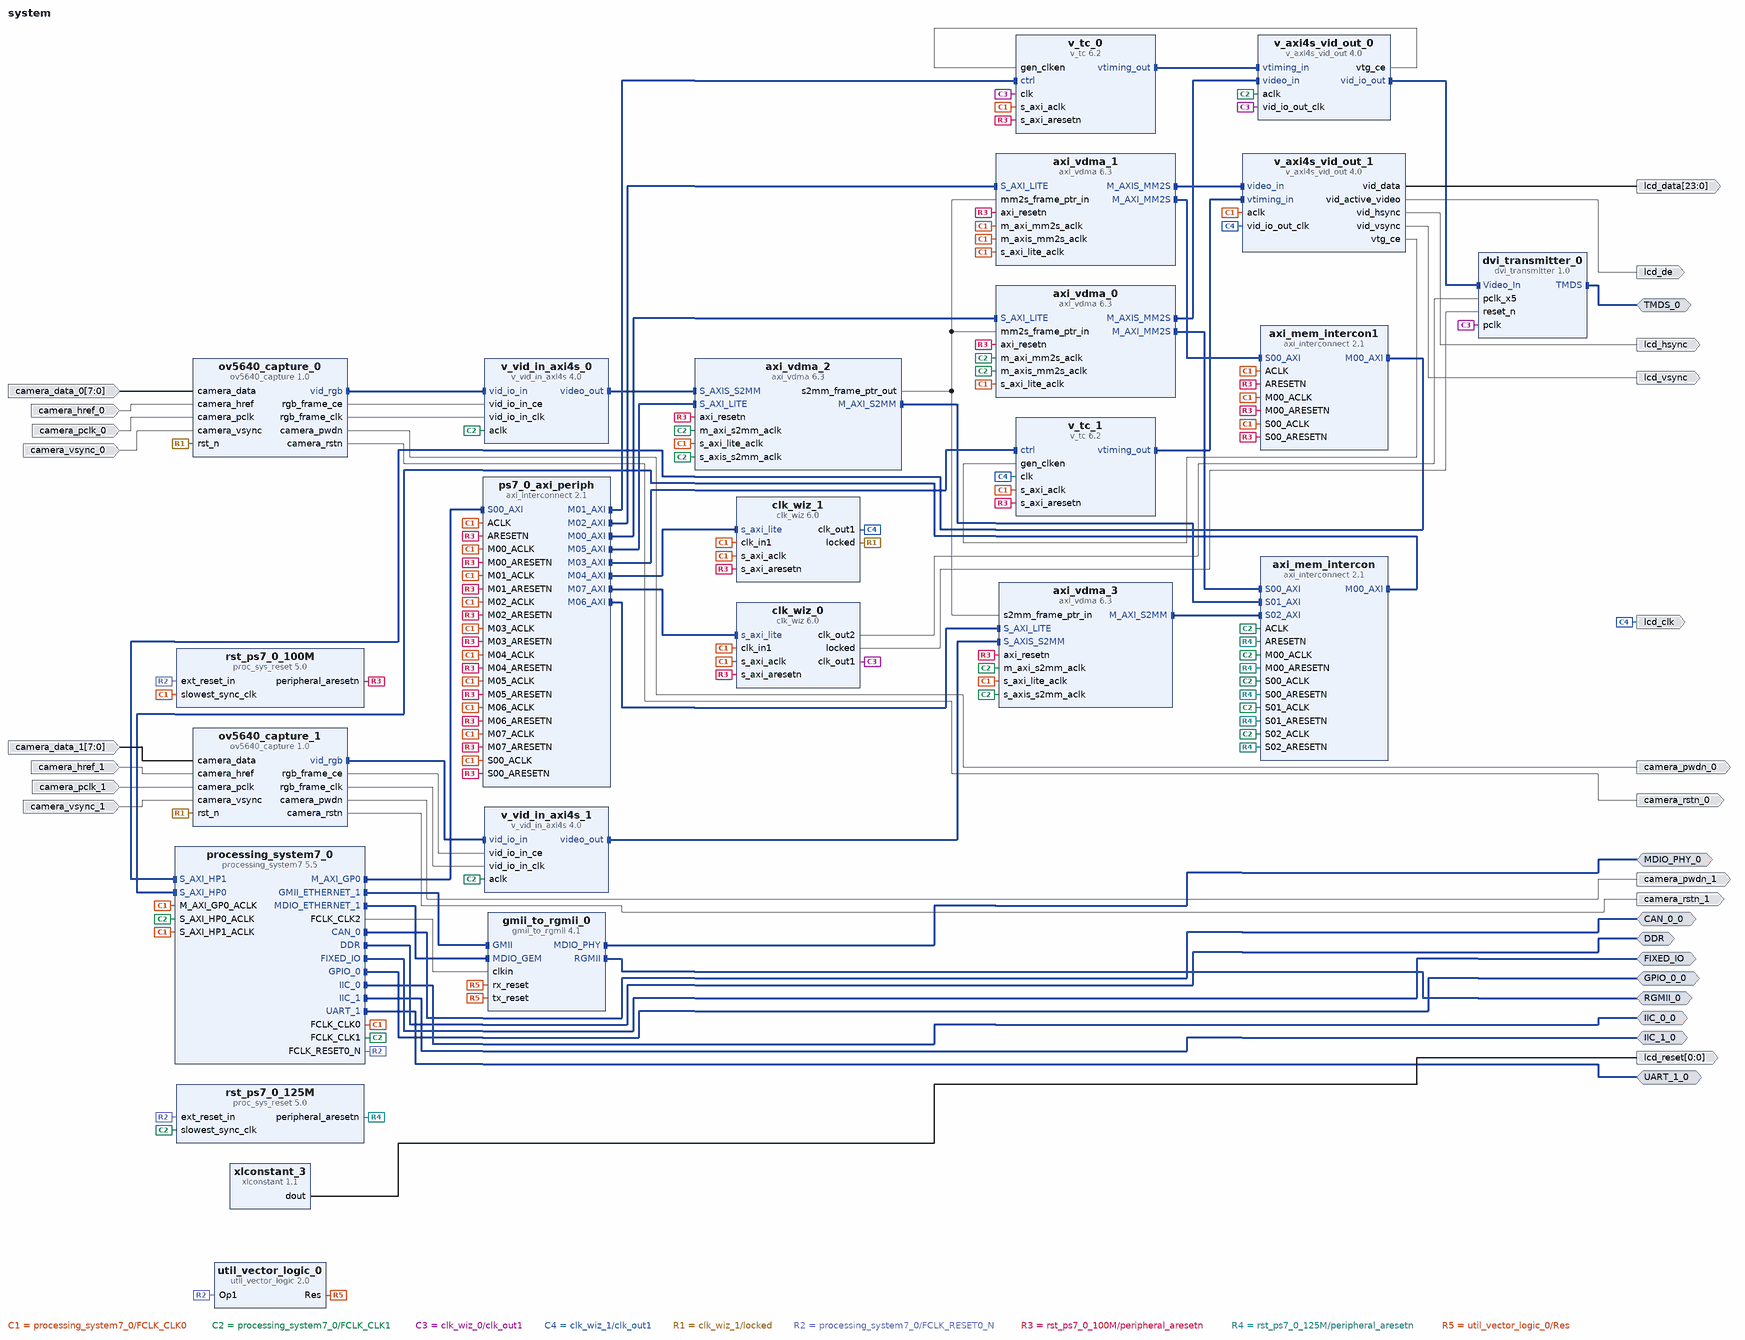
[diagram p0: block diagram of the top level]
# Vivado block design system, xc7z020clg400-2, Vivado 2021.1
create_bd_design system

create_bd_intf_port -mode Master -vlnv xilinx.com:interface:ddrx_rtl:1.0 DDR
create_bd_intf_port -mode Master -vlnv xilinx.com:display_processing_system7:fixedio_rtl:1.0 FIXED_IO
create_bd_intf_port -mode Master -vlnv xilinx.com:interface:iic_rtl:1.0 IIC_0_0
create_bd_intf_port -mode Master -vlnv xilinx.com:interface:gpio_rtl:1.0 GPIO_0_0
create_bd_intf_port -mode Master -vlnv xilinx.com:interface:can_rtl:1.0 CAN_0_0
create_bd_intf_port -mode Master -vlnv xilinx.com:interface:uart_rtl:1.0 UART_1_0
create_bd_intf_port -mode Master -vlnv xilinx.com:interface:mdio_rtl:1.0 MDIO_PHY_0
create_bd_intf_port -mode Master -vlnv xilinx.com:interface:rgmii_rtl:1.0 RGMII_0
create_bd_intf_port -mode Master -vlnv xilinx.com:interface:iic_rtl:1.0 IIC_1_0
create_bd_intf_port -mode Master -vlnv minstru.com:user:TMDS_rtl:1.0 TMDS_0
create_bd_port -dir O lcd_de
create_bd_port -dir O lcd_hsync
create_bd_port -dir O lcd_vsync
create_bd_port -dir O lcd_clk
create_bd_port -dir O -from 0 -to 0 lcd_reset
create_bd_port -dir O -from 23 -to 0 lcd_data
create_bd_port -dir O -type rst camera_rstn_0
create_bd_port -dir O camera_pwdn_0
create_bd_port -dir I camera_pclk_0
create_bd_port -dir I camera_vsync_0
create_bd_port -dir I camera_href_0
create_bd_port -dir I -from 7 -to 0 camera_data_0
create_bd_port -dir I camera_pclk_1
create_bd_port -dir I camera_vsync_1
create_bd_port -dir I camera_href_1
create_bd_port -dir I -from 7 -to 0 camera_data_1
create_bd_port -dir O -type rst camera_rstn_1
create_bd_port -dir O camera_pwdn_1

create_bd_cell -type ip -vlnv xilinx.com:ip:processing_system7:5.5 processing_system7_0
set_property -dict [list \
  CONFIG.PCW_APU_PERIPHERAL_FREQMHZ 666.666666 \
  CONFIG.PCW_CAN0_CAN0_IO EMIO \
  CONFIG.PCW_CAN0_PERIPHERAL_ENABLE 1 \
  CONFIG.PCW_CPU_CPU_6X4X_MAX_RANGE 767 \
  CONFIG.PCW_ENET0_ENET0_IO {MIO 16 .. 27} \
  CONFIG.PCW_ENET0_GRP_MDIO_ENABLE 1 \
  CONFIG.PCW_ENET0_GRP_MDIO_IO {MIO 52 .. 53} \
  CONFIG.PCW_ENET0_PERIPHERAL_ENABLE 1 \
  CONFIG.PCW_ENET0_RESET_ENABLE 0 \
  CONFIG.PCW_ENET1_ENET1_IO EMIO \
  CONFIG.PCW_ENET1_GRP_MDIO_ENABLE 1 \
  CONFIG.PCW_ENET1_GRP_MDIO_IO EMIO \
  CONFIG.PCW_ENET1_PERIPHERAL_ENABLE 1 \
  CONFIG.PCW_ENET_RESET_ENABLE 1 \
  CONFIG.PCW_ENET_RESET_SELECT {Share reset pin} \
  CONFIG.PCW_EN_CLK1_PORT 1 \
  CONFIG.PCW_EN_CLK2_PORT 1 \
  CONFIG.PCW_FCLK_CLK0_BUF FALSE \
  CONFIG.PCW_FCLK_CLK1_BUF TRUE \
  CONFIG.PCW_FPGA0_PERIPHERAL_FREQMHZ 100 \
  CONFIG.PCW_FPGA1_PERIPHERAL_FREQMHZ 125 \
  CONFIG.PCW_FPGA2_PERIPHERAL_FREQMHZ 200 \
  CONFIG.PCW_FPGA_FCLK1_ENABLE 1 \
  CONFIG.PCW_FPGA_FCLK2_ENABLE 1 \
  CONFIG.PCW_GPIO_EMIO_GPIO_ENABLE 1 \
  CONFIG.PCW_GPIO_EMIO_GPIO_IO 12 \
  CONFIG.PCW_GPIO_EMIO_GPIO_WIDTH 12 \
  CONFIG.PCW_GPIO_MIO_GPIO_ENABLE 1 \
  CONFIG.PCW_GPIO_MIO_GPIO_IO MIO \
  CONFIG.PCW_I2C0_I2C0_IO EMIO \
  CONFIG.PCW_I2C0_PERIPHERAL_ENABLE 1 \
  CONFIG.PCW_I2C1_I2C1_IO EMIO \
  CONFIG.PCW_I2C1_PERIPHERAL_ENABLE 1 \
  CONFIG.PCW_I2C_PERIPHERAL_FREQMHZ 111.111115 \
  CONFIG.PCW_I2C_RESET_ENABLE 0 \
  CONFIG.PCW_PERIPHERAL_BOARD_PRESET None \
  CONFIG.PCW_PRESET_BANK1_VOLTAGE {LVCMOS 1.8V} \
  CONFIG.PCW_QSPI_GRP_SINGLE_SS_ENABLE 1 \
  CONFIG.PCW_QSPI_GRP_SINGLE_SS_IO {MIO 1 .. 6} \
  CONFIG.PCW_QSPI_PERIPHERAL_ENABLE 1 \
  CONFIG.PCW_QSPI_QSPI_IO {MIO 1 .. 6} \
  CONFIG.PCW_SD0_GRP_CD_ENABLE 1 \
  CONFIG.PCW_SD0_GRP_CD_IO {MIO 9} \
  CONFIG.PCW_SD0_GRP_WP_ENABLE 0 \
  CONFIG.PCW_SD0_PERIPHERAL_ENABLE 1 \
  CONFIG.PCW_SD0_SD0_IO {MIO 40 .. 45} \
  CONFIG.PCW_SD1_PERIPHERAL_ENABLE 1 \
  CONFIG.PCW_SD1_SD1_IO {MIO 46 .. 51} \
  CONFIG.PCW_SDIO_PERIPHERAL_FREQMHZ 100 \
  CONFIG.PCW_SINGLE_QSPI_DATA_MODE x4 \
  CONFIG.PCW_UART0_PERIPHERAL_ENABLE 1 \
  CONFIG.PCW_UART0_UART0_IO {MIO 14 .. 15} \
  CONFIG.PCW_UART1_PERIPHERAL_ENABLE 1 \
  CONFIG.PCW_UART1_UART1_IO EMIO \
  CONFIG.PCW_UART_PERIPHERAL_FREQMHZ 100 \
  CONFIG.PCW_UIPARAM_DDR_FREQ_MHZ 533.333333 \
  CONFIG.PCW_UIPARAM_DDR_MEMORY_TYPE {DDR 3 (Low Voltage)} \
  CONFIG.PCW_UIPARAM_DDR_PARTNO {MT41K256M16 RE-125} \
  CONFIG.PCW_USB0_PERIPHERAL_ENABLE 1 \
  CONFIG.PCW_USB0_RESET_ENABLE 1 \
  CONFIG.PCW_USB0_RESET_IO {MIO 10} \
  CONFIG.PCW_USB0_USB0_IO {MIO 28 .. 39} \
  CONFIG.PCW_USB_RESET_ENABLE 1 \
  CONFIG.PCW_USB_RESET_SELECT {Share reset pin} \
  CONFIG.PCW_USE_S_AXI_HP0 1 \
  CONFIG.PCW_USE_S_AXI_HP1 1 \
  CONFIG.preset None \
] [get_bd_cells processing_system7_0]
# 513 more settings of processing_system7_0 are not shown: defaults, MIO pin electricals, DDR timing, and values the tool derives
create_bd_cell -type ip -vlnv xilinx.com:ip:axi_vdma:6.3 axi_vdma_0
set_property -dict [list \
  CONFIG.c_include_s2mm 0 \
  CONFIG.c_m_axis_mm2s_tdata_width 24 \
  CONFIG.c_mm2s_genlock_mode 1 \
  CONFIG.c_mm2s_linebuffer_depth 2048 \
  CONFIG.c_mm2s_max_burst_length 64 \
  CONFIG.c_num_fstores 1 \
] [get_bd_cells axi_vdma_0]
create_bd_cell -type ip -vlnv xilinx.com:ip:v_tc:6.2 v_tc_0
set_property -dict {CONFIG.enable_detection false} [get_bd_cells v_tc_0]
create_bd_cell -type ip -vlnv xilinx.com:ip:v_axi4s_vid_out:4.0 v_axi4s_vid_out_0
set_property -dict {CONFIG.C_HAS_ASYNC_CLK 1} [get_bd_cells v_axi4s_vid_out_0]
create_bd_cell -type ip -vlnv xilinx.com:ip:clk_wiz:6.0 clk_wiz_0
set_property -dict [list \
  CONFIG.CLKOUT1_DRIVES BUFG \
  CONFIG.CLKOUT1_JITTER 151.636 \
  CONFIG.CLKOUT1_PHASE_ERROR 98.575 \
  CONFIG.CLKOUT1_REQUESTED_OUT_FREQ 50 \
  CONFIG.CLKOUT2_DRIVES No_buffer \
  CONFIG.CLKOUT2_JITTER 110.209 \
  CONFIG.CLKOUT2_PHASE_ERROR 98.575 \
  CONFIG.CLKOUT2_REQUESTED_OUT_FREQ 250 \
  CONFIG.CLKOUT2_USED true \
  CONFIG.CLKOUT3_DRIVES BUFG \
  CONFIG.CLKOUT4_DRIVES BUFG \
  CONFIG.CLKOUT5_DRIVES BUFG \
  CONFIG.CLKOUT6_DRIVES BUFG \
  CONFIG.CLKOUT7_DRIVES BUFG \
  CONFIG.MMCM_CLKFBOUT_MULT_F 10.000 \
  CONFIG.MMCM_CLKOUT0_DIVIDE_F 20.000 \
  CONFIG.MMCM_CLKOUT1_DIVIDE 4 \
  CONFIG.MMCM_DIVCLK_DIVIDE 1 \
  CONFIG.NUM_OUT_CLKS 2 \
  CONFIG.SECONDARY_SOURCE Single_ended_clock_capable_pin \
  CONFIG.USE_DYN_RECONFIG true \
  CONFIG.USE_PHASE_ALIGNMENT true \
] [get_bd_cells clk_wiz_0]
create_bd_cell -type ip -vlnv xilinx.com:ip:axi_interconnect:2.1 ps7_0_axi_periph
set_property -dict {CONFIG.NUM_MI 8} [get_bd_cells ps7_0_axi_periph]
create_bd_cell -type ip -vlnv xilinx.com:ip:proc_sys_reset:5.0 rst_ps7_0_100M
create_bd_cell -type ip -vlnv xilinx.com:ip:axi_interconnect:2.1 axi_mem_intercon
set_property -dict {CONFIG.NUM_MI 1 CONFIG.NUM_SI 3} [get_bd_cells axi_mem_intercon]
create_bd_cell -type ip -vlnv xilinx.com:ip:proc_sys_reset:5.0 rst_ps7_0_125M
create_bd_cell -type ip -vlnv xilinx.com:ip:util_vector_logic:2.0 util_vector_logic_0
set_property -dict {CONFIG.C_OPERATION not CONFIG.C_SIZE 1} [get_bd_cells util_vector_logic_0]
create_bd_cell -type ip -vlnv xilinx.com:ip:v_axi4s_vid_out:4.0 v_axi4s_vid_out_1
set_property -dict {CONFIG.C_HAS_ASYNC_CLK 1 CONFIG.C_NATIVE_COMPONENT_WIDTH 8} [get_bd_cells v_axi4s_vid_out_1]
create_bd_cell -type ip -vlnv xilinx.com:ip:v_tc:6.2 v_tc_1
set_property -dict [list \
  CONFIG.GEN_F0_VBLANK_HEND 1024 \
  CONFIG.GEN_F0_VBLANK_HSTART 1024 \
  CONFIG.GEN_F0_VFRAME_SIZE 635 \
  CONFIG.GEN_F0_VSYNC_HEND 1024 \
  CONFIG.GEN_F0_VSYNC_HSTART 1024 \
  CONFIG.GEN_F0_VSYNC_VEND 615 \
  CONFIG.GEN_F0_VSYNC_VSTART 612 \
  CONFIG.GEN_HACTIVE_SIZE 1024 \
  CONFIG.GEN_HFRAME_SIZE 1344 \
  CONFIG.GEN_HSYNC_END 1204 \
  CONFIG.GEN_HSYNC_START 1184 \
  CONFIG.GEN_VACTIVE_SIZE 600 \
  CONFIG.VIDEO_MODE Custom \
  CONFIG.enable_detection false \
] [get_bd_cells v_tc_1]
create_bd_cell -type ip -vlnv xilinx.com:ip:clk_wiz:6.0 clk_wiz_1
set_property -dict [list \
  CONFIG.CLKOUT1_JITTER 165.726 \
  CONFIG.CLKOUT1_PHASE_ERROR 98.575 \
  CONFIG.CLKOUT1_REQUESTED_OUT_FREQ 33.33333 \
  CONFIG.MMCM_CLKFBOUT_MULT_F 10.000 \
  CONFIG.MMCM_CLKOUT0_DIVIDE_F 30.000 \
  CONFIG.MMCM_DIVCLK_DIVIDE 1 \
  CONFIG.USE_DYN_RECONFIG true \
] [get_bd_cells clk_wiz_1]
create_bd_cell -type ip -vlnv xilinx.com:ip:axi_vdma:6.3 axi_vdma_1
set_property -dict [list \
  CONFIG.c_include_s2mm 0 \
  CONFIG.c_m_axis_mm2s_tdata_width 24 \
  CONFIG.c_mm2s_genlock_mode 1 \
  CONFIG.c_mm2s_linebuffer_depth 2048 \
  CONFIG.c_mm2s_max_burst_length 64 \
  CONFIG.c_num_fstores 3 \
] [get_bd_cells axi_vdma_1]
create_bd_cell -type ip -vlnv xilinx.com:ip:xlconstant:1.1 xlconstant_3
create_bd_cell -type ip -vlnv xilinx.com:ip:axi_interconnect:2.1 axi_mem_intercon1
set_property -dict {CONFIG.NUM_MI 1 CONFIG.NUM_SI 1} [get_bd_cells axi_mem_intercon1]
create_bd_cell -type ip -vlnv xilinx.com:ip:gmii_to_rgmii:4.1 gmii_to_rgmii_0
set_property -dict {CONFIG.SupportLevel Include_Shared_Logic_in_Core} [get_bd_cells gmii_to_rgmii_0]
create_bd_cell -type ip -vlnv xilinx.com:ip:v_vid_in_axi4s:4.0 v_vid_in_axi4s_0
set_property -dict {CONFIG.C_HAS_ASYNC_CLK 1} [get_bd_cells v_vid_in_axi4s_0]
create_bd_cell -type ip -vlnv xilinx.com:ip:v_vid_in_axi4s:4.0 v_vid_in_axi4s_1
set_property -dict {CONFIG.C_HAS_ASYNC_CLK 1} [get_bd_cells v_vid_in_axi4s_1]
create_bd_cell -type ip -vlnv xilinx.com:ip:axi_vdma:6.3 axi_vdma_2
set_property -dict [list \
  CONFIG.c_include_mm2s 0 \
  CONFIG.c_include_s2mm 1 \
  CONFIG.c_mm2s_genlock_mode 0 \
  CONFIG.c_num_fstores 3 \
  CONFIG.c_s2mm_genlock_mode 0 \
  CONFIG.c_s2mm_linebuffer_depth 2048 \
  CONFIG.c_s2mm_max_burst_length 64 \
] [get_bd_cells axi_vdma_2]
create_bd_cell -type ip -vlnv xilinx.com:ip:axi_vdma:6.3 axi_vdma_3
set_property -dict [list \
  CONFIG.c_include_mm2s 0 \
  CONFIG.c_include_s2mm 1 \
  CONFIG.c_m_axis_mm2s_tdata_width 32 \
  CONFIG.c_mm2s_genlock_mode 0 \
  CONFIG.c_num_fstores 3 \
  CONFIG.c_s2mm_genlock_mode 1 \
  CONFIG.c_s2mm_linebuffer_depth 2048 \
  CONFIG.c_s2mm_max_burst_length 64 \
] [get_bd_cells axi_vdma_3]
create_bd_cell -type ip -vlnv minstru.com:user:ov5640_capture:1.0 ov5640_capture_0
create_bd_cell -type ip -vlnv minstru.com:user:ov5640_capture:1.0 ov5640_capture_1
create_bd_cell -type ip -vlnv minstru.com:user:dvi_transmitter:1.0 dvi_transmitter_0

# ---- connections ----

connect_bd_intf_net [get_bd_intf_pins axi_mem_intercon1/M00_AXI] [get_bd_intf_pins processing_system7_0/S_AXI_HP1]
connect_bd_intf_net [get_bd_intf_pins axi_mem_intercon/M00_AXI] [get_bd_intf_pins processing_system7_0/S_AXI_HP0]
connect_bd_intf_net [get_bd_intf_pins axi_vdma_0/M_AXIS_MM2S] [get_bd_intf_pins v_axi4s_vid_out_0/video_in]
connect_bd_intf_net [get_bd_intf_pins axi_vdma_0/M_AXI_MM2S] [get_bd_intf_pins axi_mem_intercon/S00_AXI]
connect_bd_intf_net [get_bd_intf_pins axi_vdma_1/M_AXIS_MM2S] [get_bd_intf_pins v_axi4s_vid_out_1/video_in]
connect_bd_intf_net [get_bd_intf_pins axi_vdma_1/M_AXI_MM2S] [get_bd_intf_pins axi_mem_intercon1/S00_AXI]
connect_bd_intf_net [get_bd_intf_pins axi_vdma_2/M_AXI_S2MM] [get_bd_intf_pins axi_mem_intercon/S01_AXI]
connect_bd_intf_net [get_bd_intf_pins axi_vdma_3/M_AXI_S2MM] [get_bd_intf_pins axi_mem_intercon/S02_AXI]
connect_bd_intf_net [get_bd_intf_ports TMDS_0] [get_bd_intf_pins dvi_transmitter_0/TMDS]
connect_bd_intf_net [get_bd_intf_ports MDIO_PHY_0] [get_bd_intf_pins gmii_to_rgmii_0/MDIO_PHY]
connect_bd_intf_net [get_bd_intf_ports RGMII_0] [get_bd_intf_pins gmii_to_rgmii_0/RGMII]
connect_bd_intf_net [get_bd_intf_pins ov5640_capture_0/vid_rgb] [get_bd_intf_pins v_vid_in_axi4s_0/vid_io_in]
connect_bd_intf_net [get_bd_intf_pins ov5640_capture_1/vid_rgb] [get_bd_intf_pins v_vid_in_axi4s_1/vid_io_in]
connect_bd_intf_net [get_bd_intf_ports CAN_0_0] [get_bd_intf_pins processing_system7_0/CAN_0]
connect_bd_intf_net [get_bd_intf_ports DDR] [get_bd_intf_pins processing_system7_0/DDR]
connect_bd_intf_net [get_bd_intf_ports FIXED_IO] [get_bd_intf_pins processing_system7_0/FIXED_IO]
connect_bd_intf_net [get_bd_intf_pins processing_system7_0/GMII_ETHERNET_1] [get_bd_intf_pins gmii_to_rgmii_0/GMII]
connect_bd_intf_net [get_bd_intf_ports GPIO_0_0] [get_bd_intf_pins processing_system7_0/GPIO_0]
connect_bd_intf_net [get_bd_intf_ports IIC_0_0] [get_bd_intf_pins processing_system7_0/IIC_0]
connect_bd_intf_net [get_bd_intf_ports IIC_1_0] [get_bd_intf_pins processing_system7_0/IIC_1]
connect_bd_intf_net [get_bd_intf_pins processing_system7_0/MDIO_ETHERNET_1] [get_bd_intf_pins gmii_to_rgmii_0/MDIO_GEM]
connect_bd_intf_net [get_bd_intf_pins processing_system7_0/M_AXI_GP0] [get_bd_intf_pins ps7_0_axi_periph/S00_AXI]
connect_bd_intf_net [get_bd_intf_ports UART_1_0] [get_bd_intf_pins processing_system7_0/UART_1]
connect_bd_intf_net [get_bd_intf_pins ps7_0_axi_periph/M00_AXI] [get_bd_intf_pins axi_vdma_0/S_AXI_LITE]
connect_bd_intf_net [get_bd_intf_pins ps7_0_axi_periph/M01_AXI] [get_bd_intf_pins v_tc_0/ctrl]
connect_bd_intf_net [get_bd_intf_pins axi_vdma_1/S_AXI_LITE] [get_bd_intf_pins ps7_0_axi_periph/M02_AXI]
connect_bd_intf_net [get_bd_intf_pins ps7_0_axi_periph/M03_AXI] [get_bd_intf_pins v_tc_1/ctrl]
connect_bd_intf_net [get_bd_intf_pins ps7_0_axi_periph/M04_AXI] [get_bd_intf_pins clk_wiz_1/s_axi_lite]
connect_bd_intf_net [get_bd_intf_pins ps7_0_axi_periph/M05_AXI] [get_bd_intf_pins axi_vdma_2/S_AXI_LITE]
connect_bd_intf_net [get_bd_intf_pins ps7_0_axi_periph/M06_AXI] [get_bd_intf_pins axi_vdma_3/S_AXI_LITE]
connect_bd_intf_net [get_bd_intf_pins ps7_0_axi_periph/M07_AXI] [get_bd_intf_pins clk_wiz_0/s_axi_lite]
connect_bd_intf_net [get_bd_intf_pins v_axi4s_vid_out_0/vid_io_out] [get_bd_intf_pins dvi_transmitter_0/Video_In]
connect_bd_intf_net [get_bd_intf_pins v_tc_0/vtiming_out] [get_bd_intf_pins v_axi4s_vid_out_0/vtiming_in]
connect_bd_intf_net [get_bd_intf_pins v_tc_1/vtiming_out] [get_bd_intf_pins v_axi4s_vid_out_1/vtiming_in]
connect_bd_intf_net [get_bd_intf_pins v_vid_in_axi4s_0/video_out] [get_bd_intf_pins axi_vdma_2/S_AXIS_S2MM]
connect_bd_intf_net [get_bd_intf_pins v_vid_in_axi4s_1/video_out] [get_bd_intf_pins axi_vdma_3/S_AXIS_S2MM]
connect_bd_net [get_bd_pins processing_system7_0/FCLK_CLK0] \
  [get_bd_pins axi_vdma_0/s_axi_lite_aclk] [get_bd_pins v_tc_0/s_axi_aclk] [get_bd_pins clk_wiz_0/clk_in1] \
  [get_bd_pins processing_system7_0/M_AXI_GP0_ACLK] [get_bd_pins ps7_0_axi_periph/ACLK] \
  [get_bd_pins ps7_0_axi_periph/S00_ACLK] [get_bd_pins rst_ps7_0_100M/slowest_sync_clk] \
  [get_bd_pins ps7_0_axi_periph/M00_ACLK] [get_bd_pins ps7_0_axi_periph/M01_ACLK] [get_bd_pins clk_wiz_1/clk_in1] \
  [get_bd_pins v_axi4s_vid_out_1/aclk] [get_bd_pins ps7_0_axi_periph/M02_ACLK] [get_bd_pins v_tc_1/s_axi_aclk] \
  [get_bd_pins ps7_0_axi_periph/M03_ACLK] [get_bd_pins clk_wiz_1/s_axi_aclk] [get_bd_pins ps7_0_axi_periph/M04_ACLK] \
  [get_bd_pins processing_system7_0/S_AXI_HP1_ACLK] [get_bd_pins axi_vdma_1/s_axi_lite_aclk] \
  [get_bd_pins axi_vdma_1/m_axis_mm2s_aclk] [get_bd_pins axi_vdma_1/m_axi_mm2s_aclk] [get_bd_pins axi_mem_intercon1/M00_ACLK] \
  [get_bd_pins axi_mem_intercon1/S00_ACLK] [get_bd_pins axi_mem_intercon1/ACLK] [get_bd_pins axi_vdma_2/s_axi_lite_aclk] \
  [get_bd_pins axi_vdma_3/s_axi_lite_aclk] [get_bd_pins ps7_0_axi_periph/M05_ACLK] [get_bd_pins ps7_0_axi_periph/M06_ACLK] \
  [get_bd_pins ps7_0_axi_periph/M07_ACLK] [get_bd_pins clk_wiz_0/s_axi_aclk]
connect_bd_net [get_bd_pins processing_system7_0/FCLK_CLK1] \
  [get_bd_pins axi_vdma_0/m_axi_mm2s_aclk] [get_bd_pins v_axi4s_vid_out_0/aclk] [get_bd_pins axi_vdma_0/m_axis_mm2s_aclk] \
  [get_bd_pins processing_system7_0/S_AXI_HP0_ACLK] [get_bd_pins axi_mem_intercon/ACLK] \
  [get_bd_pins axi_mem_intercon/S00_ACLK] [get_bd_pins rst_ps7_0_125M/slowest_sync_clk] \
  [get_bd_pins axi_mem_intercon/M00_ACLK] [get_bd_pins axi_mem_intercon/S01_ACLK] [get_bd_pins axi_mem_intercon/S02_ACLK] \
  [get_bd_pins v_vid_in_axi4s_1/aclk] [get_bd_pins v_vid_in_axi4s_0/aclk] [get_bd_pins axi_vdma_3/s_axis_s2mm_aclk] \
  [get_bd_pins axi_vdma_3/m_axi_s2mm_aclk] [get_bd_pins axi_vdma_2/s_axis_s2mm_aclk] [get_bd_pins axi_vdma_2/m_axi_s2mm_aclk]
connect_bd_net [get_bd_pins axi_vdma_2/s2mm_frame_ptr_out] \
  [get_bd_pins axi_vdma_3/s2mm_frame_ptr_in] [get_bd_pins axi_vdma_0/mm2s_frame_ptr_in] \
  [get_bd_pins axi_vdma_1/mm2s_frame_ptr_in]
connect_bd_net -net camera_data_0_1 [get_bd_ports camera_data_0] [get_bd_pins ov5640_capture_0/camera_data]
connect_bd_net -net camera_data_1_1 [get_bd_ports camera_data_1] [get_bd_pins ov5640_capture_1/camera_data]
connect_bd_net -net camera_href_0_1 [get_bd_ports camera_href_0] [get_bd_pins ov5640_capture_0/camera_href]
connect_bd_net -net camera_href_1_1 [get_bd_ports camera_href_1] [get_bd_pins ov5640_capture_1/camera_href]
connect_bd_net -net camera_pclk_0_1 [get_bd_ports camera_pclk_0] [get_bd_pins ov5640_capture_0/camera_pclk]
connect_bd_net -net camera_pclk_1_1 [get_bd_ports camera_pclk_1] [get_bd_pins ov5640_capture_1/camera_pclk]
connect_bd_net -net camera_vsync_0_1 [get_bd_ports camera_vsync_0] [get_bd_pins ov5640_capture_0/camera_vsync]
connect_bd_net -net camera_vsync_1_1 [get_bd_ports camera_vsync_1] [get_bd_pins ov5640_capture_1/camera_vsync]
connect_bd_net [get_bd_pins clk_wiz_0/clk_out1] \
  [get_bd_pins v_tc_0/clk] [get_bd_pins v_axi4s_vid_out_0/vid_io_out_clk] [get_bd_pins dvi_transmitter_0/pclk]
connect_bd_net [get_bd_pins clk_wiz_0/clk_out2] [get_bd_pins dvi_transmitter_0/pclk_x5]
connect_bd_net [get_bd_pins clk_wiz_0/locked] [get_bd_pins dvi_transmitter_0/reset_n]
connect_bd_net [get_bd_pins clk_wiz_1/clk_out1] [get_bd_pins v_tc_1/clk] [get_bd_pins v_axi4s_vid_out_1/vid_io_out_clk] [get_bd_ports lcd_clk]
connect_bd_net [get_bd_pins clk_wiz_1/locked] [get_bd_pins ov5640_capture_0/rst_n] [get_bd_pins ov5640_capture_1/rst_n]
connect_bd_net [get_bd_pins ov5640_capture_0/camera_pwdn] [get_bd_ports camera_pwdn_0]
connect_bd_net [get_bd_pins ov5640_capture_0/camera_rstn] [get_bd_ports camera_rstn_0]
connect_bd_net [get_bd_pins ov5640_capture_0/rgb_frame_ce] [get_bd_pins v_vid_in_axi4s_0/vid_io_in_ce]
connect_bd_net [get_bd_pins ov5640_capture_0/rgb_frame_clk] [get_bd_pins v_vid_in_axi4s_0/vid_io_in_clk]
connect_bd_net [get_bd_pins ov5640_capture_1/camera_pwdn] [get_bd_ports camera_pwdn_1]
connect_bd_net [get_bd_pins ov5640_capture_1/camera_rstn] [get_bd_ports camera_rstn_1]
connect_bd_net [get_bd_pins ov5640_capture_1/rgb_frame_ce] [get_bd_pins v_vid_in_axi4s_1/vid_io_in_ce]
connect_bd_net [get_bd_pins ov5640_capture_1/rgb_frame_clk] [get_bd_pins v_vid_in_axi4s_1/vid_io_in_clk]
connect_bd_net [get_bd_pins processing_system7_0/FCLK_CLK2] [get_bd_pins gmii_to_rgmii_0/clkin]
connect_bd_net [get_bd_pins processing_system7_0/FCLK_RESET0_N] \
  [get_bd_pins rst_ps7_0_100M/ext_reset_in] [get_bd_pins rst_ps7_0_125M/ext_reset_in] [get_bd_pins util_vector_logic_0/Op1]
connect_bd_net [get_bd_pins rst_ps7_0_100M/peripheral_aresetn] \
  [get_bd_pins ps7_0_axi_periph/S00_ARESETN] [get_bd_pins axi_vdma_0/axi_resetn] [get_bd_pins v_tc_0/s_axi_aresetn] \
  [get_bd_pins ps7_0_axi_periph/M00_ARESETN] [get_bd_pins ps7_0_axi_periph/ARESETN] \
  [get_bd_pins ps7_0_axi_periph/M01_ARESETN] [get_bd_pins ps7_0_axi_periph/M02_ARESETN] [get_bd_pins v_tc_1/s_axi_aresetn] \
  [get_bd_pins ps7_0_axi_periph/M03_ARESETN] [get_bd_pins clk_wiz_1/s_axi_aresetn] [get_bd_pins ps7_0_axi_periph/M04_ARESETN] \
  [get_bd_pins axi_vdma_1/axi_resetn] [get_bd_pins axi_mem_intercon1/M00_ARESETN] [get_bd_pins axi_mem_intercon1/S00_ARESETN] \
  [get_bd_pins axi_mem_intercon1/ARESETN] [get_bd_pins axi_vdma_2/axi_resetn] [get_bd_pins axi_vdma_3/axi_resetn] \
  [get_bd_pins ps7_0_axi_periph/M05_ARESETN] [get_bd_pins ps7_0_axi_periph/M06_ARESETN] \
  [get_bd_pins ps7_0_axi_periph/M07_ARESETN] [get_bd_pins clk_wiz_0/s_axi_aresetn]
connect_bd_net -net rst_ps7_0_142M_peripheral_aresetn [get_bd_pins rst_ps7_0_125M/peripheral_aresetn] \
  [get_bd_pins axi_mem_intercon/S00_ARESETN] [get_bd_pins axi_mem_intercon/M00_ARESETN] \
  [get_bd_pins axi_mem_intercon/ARESETN] [get_bd_pins axi_mem_intercon/S01_ARESETN] \
  [get_bd_pins axi_mem_intercon/S02_ARESETN]
connect_bd_net [get_bd_pins util_vector_logic_0/Res] [get_bd_pins gmii_to_rgmii_0/tx_reset] [get_bd_pins gmii_to_rgmii_0/rx_reset]
connect_bd_net [get_bd_pins v_axi4s_vid_out_0/vtg_ce] [get_bd_pins v_tc_0/gen_clken]
connect_bd_net [get_bd_pins v_axi4s_vid_out_1/vid_active_video] [get_bd_ports lcd_de]
connect_bd_net [get_bd_pins v_axi4s_vid_out_1/vid_data] [get_bd_ports lcd_data]
connect_bd_net [get_bd_pins v_axi4s_vid_out_1/vid_hsync] [get_bd_ports lcd_hsync]
connect_bd_net [get_bd_pins v_axi4s_vid_out_1/vid_vsync] [get_bd_ports lcd_vsync]
connect_bd_net [get_bd_pins v_axi4s_vid_out_1/vtg_ce] [get_bd_pins v_tc_1/gen_clken]
connect_bd_net [get_bd_pins xlconstant_3/dout] [get_bd_ports lcd_reset]

# ---- address map ----
assign_bd_address -offset 0x00000000 -range 1G -target_address_space [get_bd_addr_spaces axi_vdma_0/Data_MM2S] [get_bd_addr_segs processing_system7_0/S_AXI_HP0/HP0_DDR_LOWOCM]
assign_bd_address -offset 0x00000000 -range 1G -target_address_space [get_bd_addr_spaces axi_vdma_1/Data_MM2S] [get_bd_addr_segs processing_system7_0/S_AXI_HP1/HP1_DDR_LOWOCM]
assign_bd_address -offset 0x00000000 -range 1G -target_address_space [get_bd_addr_spaces axi_vdma_2/Data_S2MM] [get_bd_addr_segs processing_system7_0/S_AXI_HP0/HP0_DDR_LOWOCM]
assign_bd_address -offset 0x00000000 -range 1G -target_address_space [get_bd_addr_spaces axi_vdma_3/Data_S2MM] [get_bd_addr_segs processing_system7_0/S_AXI_HP0/HP0_DDR_LOWOCM]
assign_bd_address -offset 0x40000000 -range 64K -target_address_space [get_bd_addr_spaces processing_system7_0/Data] [get_bd_addr_segs clk_wiz_0/s_axi_lite/Reg]
assign_bd_address -offset 0x43000000 -range 64K -target_address_space [get_bd_addr_spaces processing_system7_0/Data] [get_bd_addr_segs axi_vdma_0/S_AXI_LITE/Reg]
assign_bd_address -offset 0x43010000 -range 64K -target_address_space [get_bd_addr_spaces processing_system7_0/Data] [get_bd_addr_segs axi_vdma_1/S_AXI_LITE/Reg]
assign_bd_address -offset 0x43020000 -range 64K -target_address_space [get_bd_addr_spaces processing_system7_0/Data] [get_bd_addr_segs axi_vdma_2/S_AXI_LITE/Reg]
assign_bd_address -offset 0x43030000 -range 64K -target_address_space [get_bd_addr_spaces processing_system7_0/Data] [get_bd_addr_segs axi_vdma_3/S_AXI_LITE/Reg]
assign_bd_address -offset 0x43C00000 -range 64K -target_address_space [get_bd_addr_spaces processing_system7_0/Data] [get_bd_addr_segs clk_wiz_1/s_axi_lite/Reg]
assign_bd_address -offset 0x43C10000 -range 64K -target_address_space [get_bd_addr_spaces processing_system7_0/Data] [get_bd_addr_segs v_tc_0/ctrl/Reg]
assign_bd_address -offset 0x43C20000 -range 64K -target_address_space [get_bd_addr_spaces processing_system7_0/Data] [get_bd_addr_segs v_tc_1/ctrl/Reg]

validate_bd_design
save_bd_design
